# EasyEDA Pro project AD9959-DDS模块DA转换-函数发生器【国电信号仪表题】_2025-04-27_17-19-20.eprj

# Schematic AD9959-DDS模块DA转换-函数发生器【国电信号仪表题】
Board Name: AD9959-DDS模块DA转换-函数发生器【国电信号仪表题】; Create Date: 2025-07-15; Page Name: AD9959---DDS模块DA转换; Project Name: AD9959-DDS模块DA转换-函数发生器【国电信号仪表题】_2025-04-27_17-19-20; Schematic Name: AD9959-DDS模块DA转换-函数发生器【国电信号仪表题】; Update Date: 2025-07-18; Add into BOM: yes; Company: GDUT ELC; Convert to PCB: yes; Date: 2021-05-15; Draw By: 下岗工人再就业队; REV: 1.0; Sheet: 1/1
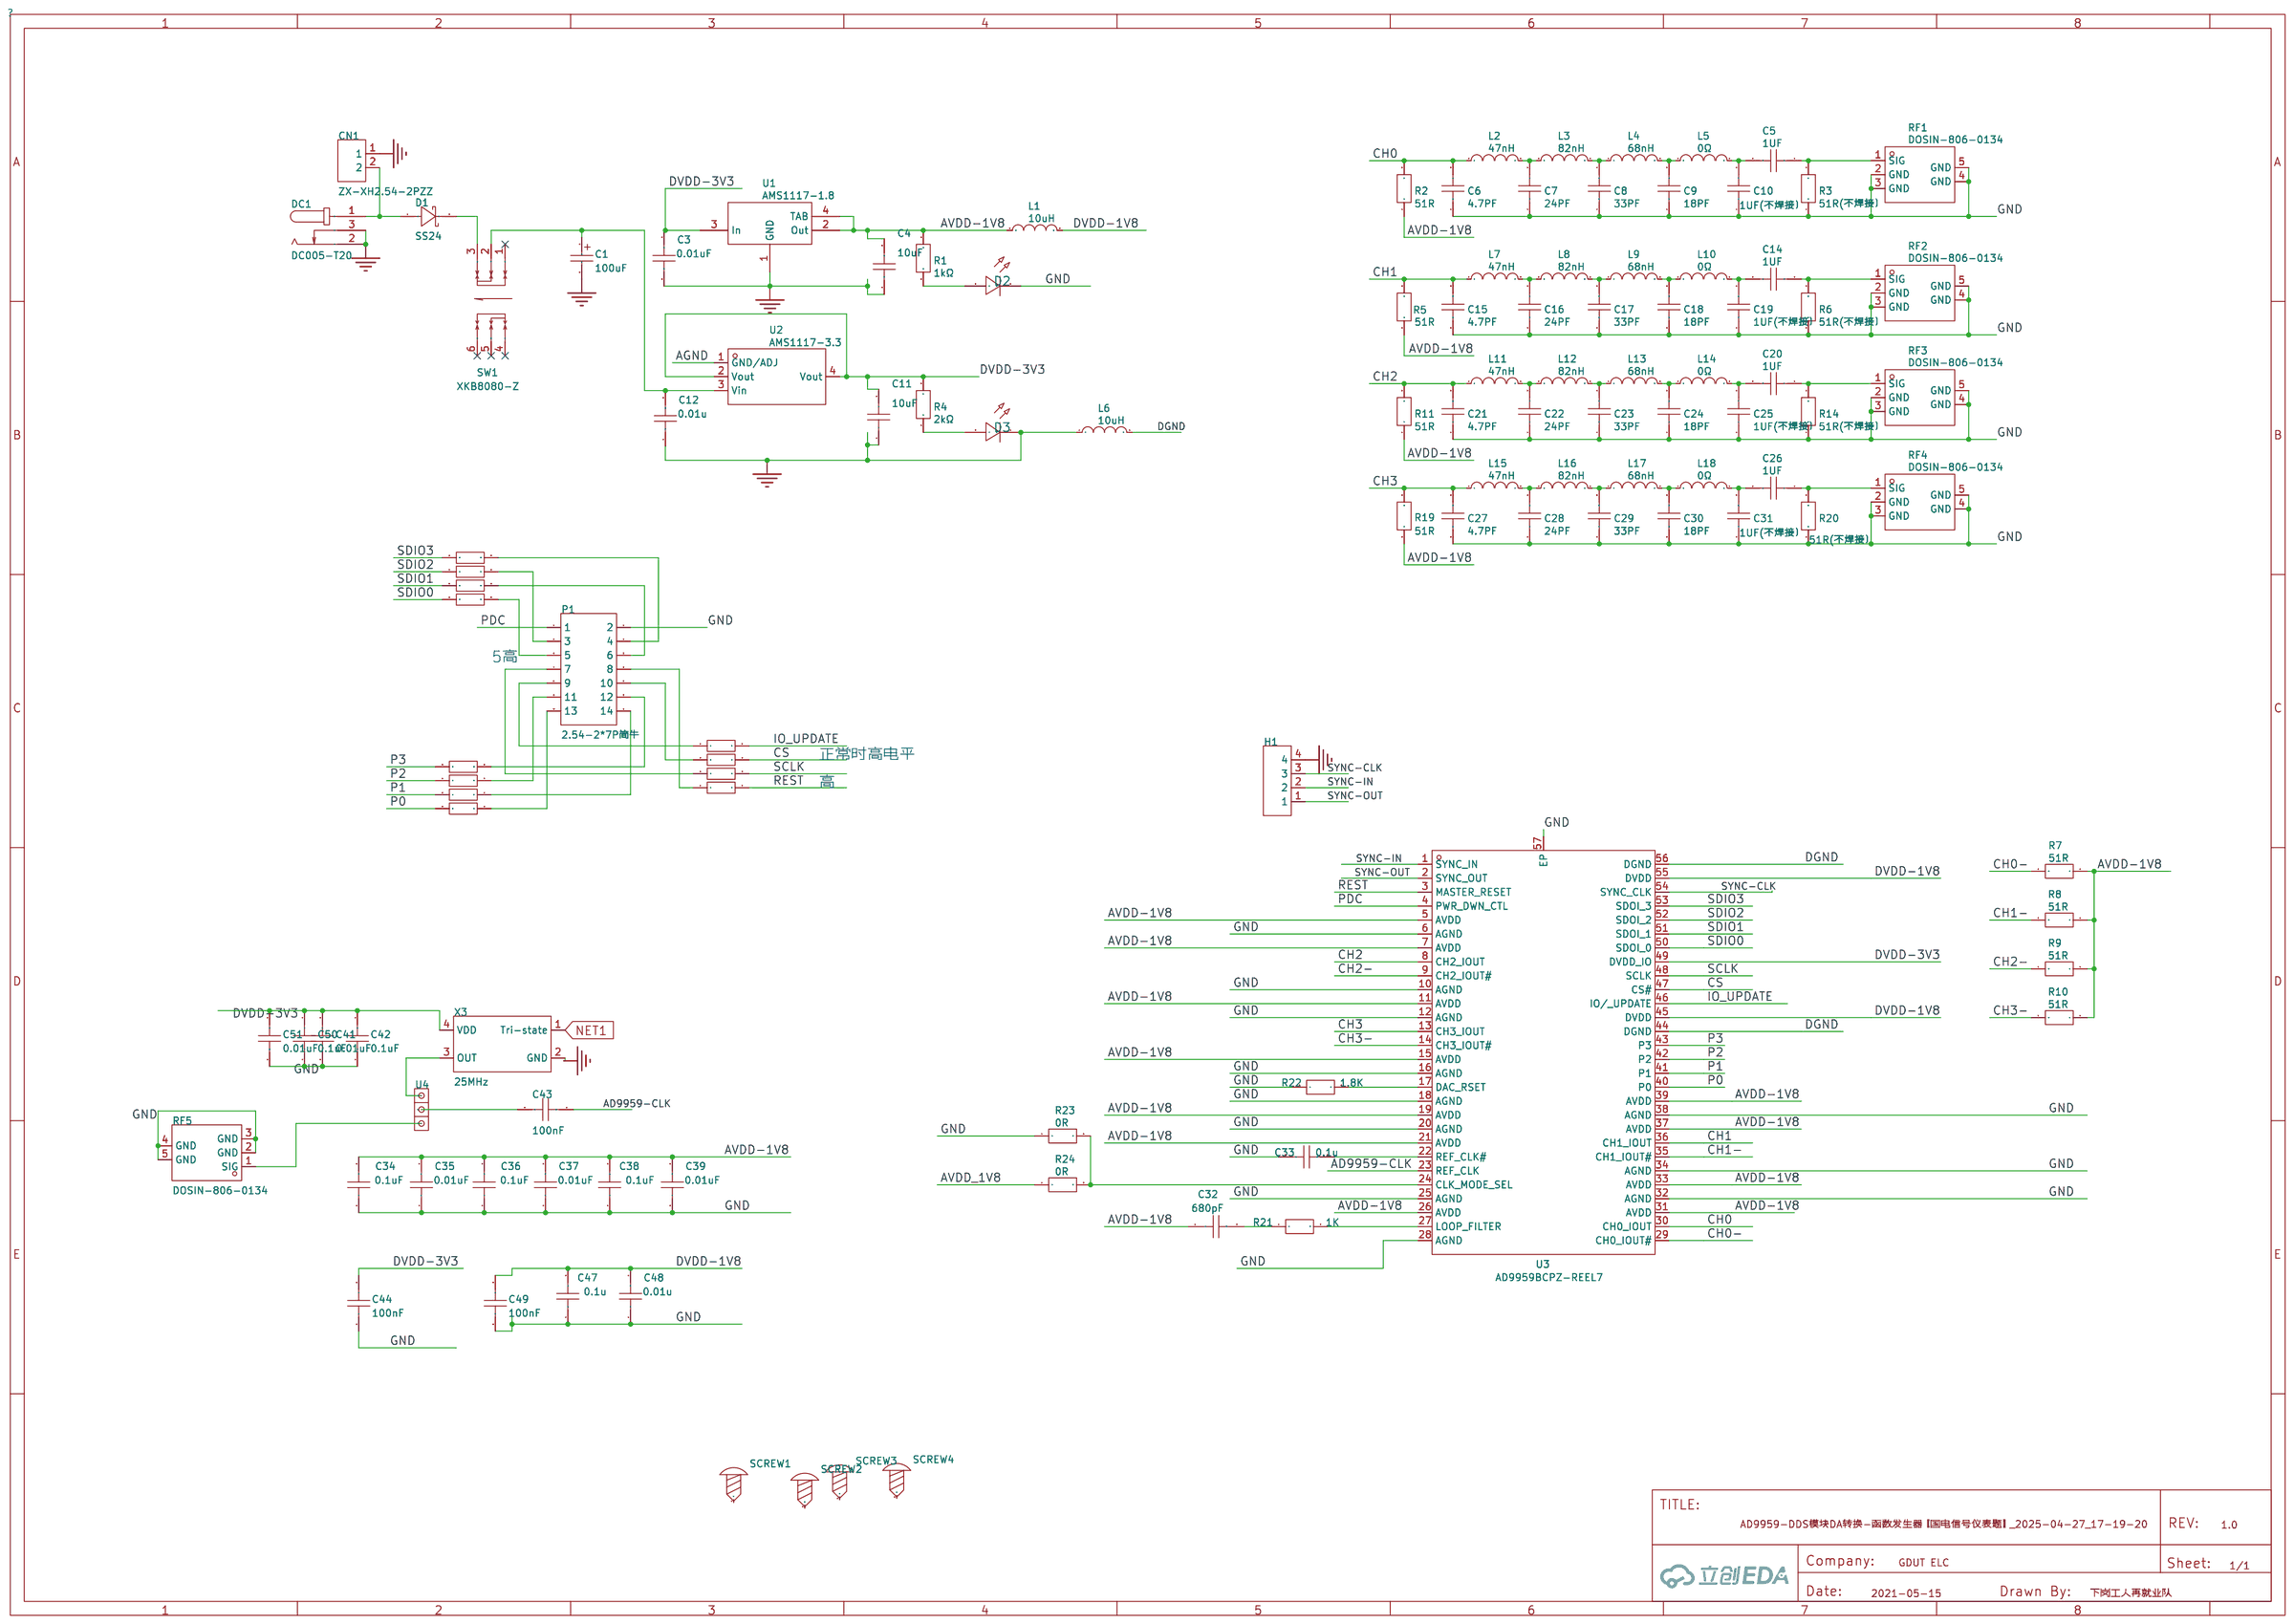
[diagram p0: schematic sheet]

## Parts
C1  100uF  [CASE-D_7343]
C3  0.01uF  [R0805]
C4  10uF  [C1210]
C5  1UF  [R0805]
C6  4.7PF  [R0805]
C7  24PF  [R0805]
C8  33PF  [R0805]
C9  18PF  [R0805]
C10  1UF(不焊接）  [R0805]
C11  10uF  [C1210]
C12  0.01u  [R0805]
C14  1UF  [R0805]
C15  4.7PF  [R0805]
C16  24PF  [R0805]
C17  33PF  [R0805]
C18  18PF  [R0805]
C19  1UF(不焊接）  [R0805]
C20  1UF  [R0805]
C21  4.7PF  [R0805]
C22  24PF  [R0805]
C23  33PF  [R0805]
C24  18PF  [R0805]
C25  1UF(不焊接）  [R0805]
C26  1UF  [R0805]
C27  4.7PF  [R0805]
C28  24PF  [R0805]
C29  33PF  [R0805]
C30  18PF  [R0805]
C31  1UF(不焊接）  [R0805]
C32  680pF  [R0805]
C33  0.1u  [R0805]
C34  0.1uF  [R0805]
C35  0.01uF  [R0805]
C36  0.1uF  [R0805]
C37  0.01uF  [R0805]
C38  0.1uF  [R0805]
C39  0.01uF  [R0805]
C41  0.01uF  [R0805]
C42  0.1uF  [R0805]
C43  100nF  [R0805]
C44  100nF  [C1206]
C47  0.1u  [R0805]
C48  0.01u  [R0805]
C49  100nF  [C1206]
C50  0.1uF  [R0805]
C51  0.01uF  [R0805]
CN1  ZX-XH2.54-2PZZ  [CONN-TH_2P-P2.50_HX25003-2A]
D1  SS24  [SMA_L4.3-W2.6-LS5.0-FD]
D2  -  [LED_0603]
D3  -  [LED_0603]
DC1  DC005-T20  [DC-IN-TH_DC005-T20]
H1  -  [HDR-TH_4P-P2.54-V-M]
L1  10uH  [R0805]
L2  47nH  [R0805]
L3  82nH  [R0805]
L4  68nH  [R0805]
L5  0Ω  [R0805]
L6  10uH  [R0805]
L7  47nH  [R0805]
L8  82nH  [R0805]
L9  68nH  [R0805]
L10  0Ω  [R0805]
L11  47nH  [R0805]
L12  82nH  [R0805]
L13  68nH  [R0805]
L14  0Ω  [R0805]
L15  47nH  [R0805]
L16  82nH  [R0805]
L17  68nH  [R0805]
L18  0Ω  [R0805]
P1  2.54-2*7P简牛  [IDC-TH_14P-P2.54-V-R2-C7-S2.54]
R1  1kΩ  [R0805]
R2  51R  [R0805]
R3  51R(不焊接）  [R0805]
R4  2kΩ  [R0805]
R5  51R  [R0805]
R6  51R(不焊接）  [R0805]
R7  51R  [R0805]
R8  51R  [R0805]
R9  51R  [R0805]
R10  51R  [R0805]
R11  51R  [R0805]
R14  51R(不焊接）  [R0805]
R19  51R  [R0805]
R20  51R(不焊接）  [R0805]
R21  1K  [R0805]
R22  1.8K  [R0805]
R23  0R  [R0805]
R24  0R  [R0805]
R25  10K  [R0805]
R26  10K  [R0805]
R27  10K  [R0805]
R28  10K  [R0805]
R29  10K  [R0805]
R30  10K  [R0805]
R31  10K  [R0805]
R32  10K  [R0805]
R33  10K  [R0805]
R34  10K  [R0805]
R35  10K  [R0805]
R36  10K  [R0805]
RF1  DOSIN-806-0134  [footprint_bc67]
RF2  DOSIN-806-0134  [footprint_bc67]
RF3  DOSIN-806-0134  [footprint_bc67]
RF4  DOSIN-806-0134  [footprint_bc67]
RF5  DOSIN-806-0134  [footprint_bc67]
SCREW1  -  [M3螺丝]
SCREW2  -  [M3螺丝]
SCREW3  -  [M3螺丝]
SCREW4  -  [M3螺丝]
SW1  XKB8080-Z  [footprint_acf5]
U1  AMS1117-1.8  [footprint_4fcc]
U2  AMS1117-3.3  [footprint_1b84]
U3  AD9959BCPZ-REEL7  [footprint_2d52]
U4  -  [1*3跳线]
X3  25MHz  [OSC-SMD_4P-L5.0-W3.2-BL_A]

## Library data of the parts
C1 = TAJD107K016RNJ: LCSC Part Name: 100uF ±10% 16V; Supplier Part: C7223; Manufacturer: Kyocera AVX; Supplier Footprint: CASE-D-7343; JLCPCB Part Class: 扩展库; Datasheet: https://atta.szlcsc.com/upload/public/pdf/source/20160107/1457707750344.pdf; Supplier: LCSC; Tolerance: ±10%; Rated Voltage: 16V; Equivalent Series Resistance(ESR): 600mΩ@100kHz; Operating Temperature: -55℃~+125℃
C3 C35 C37 C39 C41 C51 = 0.01uF
C4 C11 = CL32B106KBJNNNE: LCSC Part Name: 10uF ±10% 50V; Supplier Part: C138687; Manufacturer: SAMSUNG(三星); Supplier Footprint: 1210; JLCPCB Part Class: 扩展库; Datasheet: https://atta.szlcsc.com/upload/public/pdf/source/20190426/C138687_F326FA7378191C6A10A83DC717674AAD.pdf; Supplier: LCSC; Tolerance: ±10%; Voltage Rated: 50V; Temperature Coefficient: X7R
C5 C14 C20 C26 = 1UF
C6 C15 C21 C27 = 4.7PF
C7 C16 C22 C28 = 24PF
C8 C17 C23 C29 = 33PF
C9 C18 C24 C30 = 18PF
C10 C19 C25 C31 = 1UF(不焊接）
C12 C48 = 0.01u
C32 = 680pF
C33 C47 = 0.1u
C34 C36 C38 C42 C50 = 0.1uF
C43 = CAP_0603: Supplier Footprint: 0603
C44 C49 = CAP_1206: Supplier Footprint: 1206
CN1 = ZX-XH2.54-2PZZ: LCSC Part Name: 1x2P 间距:2.5mm 直插 系列:XH; Supplier Part: C7429632; Manufacturer: Megastar(兆星); Supplier Footprint: 插件,P=2.5mm; JLCPCB Part Class: 扩展库; Datasheet: https://atta.szlcsc.com/upload/public/pdf/source/20230619/19BA6947230AA44A04D3EDD65E618FD0.pdf; Supplier: LCSC; Pins Structure: 1x2P; Pitch: 2.5mm; Mounting Type: 直插; Reference Series: XH; Number of Pins: 2P; Number of Rows: 1; Number of PINs Per Row: 2; Current Rating: 3A; Contact Material: 黄铜; Contact Plating: 锡; Operating Temperature: -25℃~+85℃; Voltage Rating: 250V; Plastic Material: PA66; Flame Retardant Rating: UL94V-0; Color: 白色; Z-Height of the Board: 7mm; X-Length of Bottom Edge on Board (Spacing Line): 7.5mm; Y-Width of Bottom Edge on Board: 5.9mm
D1 = SS24_C7420362: LCSC Part Name: 电压:40V 电流:2A; Supplier Part: C7420362; Manufacturer: 宏迦橙; Supplier Footprint: SMA(DO-214AC); JLCPCB Part Class: 扩展库; Datasheet: https://atta.szlcsc.com/upload/public/pdf/source/20230828/2D67628D7EFDC2DD386D167E8AEA232D.pdf; Supplier: LCSC; Diode Configuration: 独立式; Forward Voltage (Vf@If): 550mV@1.0A; Reverse Voltage (Vr): 40V; Rectified Current: 2A; Reverse Leakage Current (Ir): 200uA@40V
D2 D3 = LED_0603-R: Supplier Footprint: 0603
DC1 = DC005-T20: LCSC Part Name: DC电源插座 内径:2mm 外径:6.3mm; Supplier Part: C111567; Manufacturer: SOFNG(硕方); Supplier Footprint: 插件; JLCPCB Part Class: 扩展库; Datasheet: https://atta.szlcsc.com/upload/public/pdf/source/20221107/9EED2DEB01414D87A9494EDA89F4C173.pdf; Supplier: LCSC; Connector Type: DC电源插座; Mounting Type: 弯插; Inside Contact Diameter: 2mm; Outside Contact Diameter: 6.3mm; Current Rating: 3A; Voltage Rating (Max): 12V; Operating Temperature: -10℃~+60℃
H1 = HDR-M_2.54_1x4P: Supplier Part: C492403; Supplier Footprint: 插件
L1 L6 = 10uH: Supplier: LCSC; Supplier Part: C524976; Manufacturer: Taiyo Yuden; Manufacturer Part: LK2125100K-T
L2 L7 L11 L15 = 47nH: Supplier: LCSC; Manufacturer: Sunlord; Manufacturer Part: SDCL1608C47NJTDF; Supplier Part: C29683; JLCPCB Part Class: Basic Part
L3 L8 L12 L16 = 82nH: Supplier: LCSC; Manufacturer: Sunlord; Manufacturer Part: SDCL1608C82NJTDF; Supplier Part: C23473; JLCPCB Part Class: Extended Part
L4 L9 L13 L17 = 68nH: Supplier: LCSC; Manufacturer: Sunlord; Manufacturer Part: SDCL1608C68NJTF; Supplier Part: C13415; JLCPCB Part Class: Basic Part
L5 L10 L14 L18 = 0Ω: Supplier: LCSC; Manufacturer: FH; Manufacturer Part: CBG160808U000T; Supplier Part: C43163; JLCPCB Part Class: Extended Part
P1 = 2.54-2*7P简牛: LCSC Part Name: 2.54mm 2x7P 排数:2 每排P数:7; Supplier Part: C11215; Manufacturer: BOOMELE(博穆精密); Supplier Footprint: 插件,P=2.54mm; JLCPCB Part Class: 扩展库; Datasheet: https://atta.szlcsc.com/upload/public/pdf/source/20131122/1457706661483.pdf; Supplier: LCSC; Connector Type: 简牛座; Pitch: 2.54mm; Structure: 2x7P; Holder Type: 直插; Row Spacing: 2.54mm; Number of Rows: 2; Pin Number in each Row: 7; Contact Material: 黄铜; Contact Plating: 金
R1 = 1kΩ
R2 R5 R7-R11 R19 = 51R
R3 R6 R14 R20 = 51R(不焊接）
R4 = 2kΩ
R21 = 680R
R22 = 2.0k
R23 R24 = 0R
R25-R36 = Res_0603: Supplier Footprint: 0603
RF1-RF5 = DOSIN-806-0134: Supplier: LCSC; Supplier Part: C709670; Manufacturer: dosinconn(德索五金); JLCPCB Part Class: Extended Part
SCREW1-SCREW4 = M3螺丝: Supplier Footprint: 插件
SW1 = XKB8080-Z: Supplier: LCSC; Supplier Part: C318860; Manufacturer: XKB Enterprise; JLCPCB Part Class: Extended Part
U1 = AMS1117-1.8: Supplier: LCSC; Manufacturer: AMS; image: //image.lceda.cn/szlcsc/C6185.jpg; Supplier Part: C6185; JLCPCB Part Class: Extended Part
U2 = AMS1117-3.3: Supplier: LCSC; Manufacturer: AMS; image: //image.lceda.cn/szlcsc/C6186.jpg; Supplier Part: C6186; JLCPCB Part Class: Basic Part
U3 = AD9959BCPZ-REEL7: Supplier: LCSC; Supplier Part: C653947; Manufacturer: ADI(亚德诺)/LINEAR
U4 = 1*3跳线
X3 = OT503225MJBA4SL: LCSC Part Name: YSO110TR 25MHZ 4P 5032 1.8V-3.3V ±10PPM -40~85℃（±20PPM) CMOS; Supplier Part: C717795; Manufacturer: YXC(扬兴晶振); Supplier Footprint: SMD5032-4P; JLCPCB Part Class: 扩展库; Datasheet: https://atta.szlcsc.com/upload/public/pdf/source/20240731/596E5F7673E50DA744B7F79F139FB8DF.pdf; Supplier: LCSC; Normal temperature Frequency Tolerance: ±10ppm; Output Type: CMOS; Voltage - Supply: 1.8V~3.3V; Frequency Stability: ±20ppm; Operating Temperature: -40℃~+85℃

## Nets
AGND: U2.1(GND/ADJ)
AVDD-1V8: C4.2 C32.1 C34.2 C35.2 C36.2 C37.2 C38.2 C39.2 L1.1 R1.2 R2.1 R5.1 R7.1 R8.1 R9.1 R10.1 R11.1 R19.1 U1.2(Out) U1.4(TAB) U3.5(AVDD) U3.7(AVDD) U3.11(AVDD) U3.15(AVDD) U3.19(AVDD) U3.21(AVDD) U3.26(AVDD) U3.31(AVDD) U3.33(AVDD) U3.37(AVDD) U3.39(AVDD)
AVDD_1V8: R24.1
DGND: L6.2 U3.44(DGND) U3.56(DGND)
DVDD-1V8: C47.2 C48.2 C49.2 L1.2 U3.45(DVDD) U3.55(DVDD)
DVDD-3V3: C3.2 C11.2 C41.1 C42.1 C44.2 C50.1 C51.1 R4.2 U1.3(In) U2.2(Vout) U2.4(Vout) U3.49(DVDD_IO) X3.4(VDD)
GND: C1.2 C3.1 C4.1 C6.1 C7.1 C8.1 C9.1 C10.1 C11.1 C12.1 C15.1 C16.1 C17.1 C18.1 C19.1 C21.1 C22.1 C23.1 C24.1 C25.1 C27.1 C28.1 C29.1 C30.1 C31.1 C33.1 C34.1 C35.1 C36.1 C37.1 C38.1 C39.1 C41.2 C42.2 C44.1 C47.1 C48.1 C49.1 C50.2 C51.2 CN1.1 D2.1(C) D3.1(C) DC1.2 DC1.3 H1.4 L6.1 P1.2 R3.1 R6.1 R14.1 R20.1 R22.1 R23.1 RF1.2(GND) RF1.3(GND) RF1.4(GND) RF1.5(GND) RF2.2(GND) RF2.3(GND) RF2.4(GND) RF2.5(GND) RF3.2(GND) RF3.3(GND) RF3.4(GND) RF3.5(GND) RF4.2(GND) RF4.3(GND) RF4.4(GND) RF4.5(GND) RF5.2(GND) RF5.3(GND) RF5.4(GND) RF5.5(GND) U1.1(GND) U3.6(AGND) U3.10(AGND) U3.12(AGND) U3.16(AGND) U3.18(AGND) U3.20(AGND) U3.25(AGND) U3.28(AGND) U3.32(AGND) U3.34(AGND) U3.38(AGND) U3.57(EP) X3.2(GND)
AD9959-CLK: C43.2 U3.23(REF_CLK)
CH0: C6.2 L2.1 R2.2 U3.30(CH0_IOUT)
CH0-: R7.2 U3.29(CH0_IOUT#)
CH1: C15.2 L7.1 R5.2 U3.36(CH1_IOUT)
CH1-: R8.2 U3.35(CH1_IOUT#)
CH2: C21.2 L11.1 R11.2 U3.8(CH2_IOUT)
CH2-: R9.2 U3.9(CH2_IOUT#)
CH3: C27.2 L15.1 R19.2 U3.13(CH3_IOUT)
CH3-: R10.2 U3.14(CH3_IOUT#)
CS: R34.2 U3.47(CS#)
IO_UPDATE: R33.2 U3.46(IO/_UPDATE)
NET1: X3.1(Tri-state)
P0: R32.1 U3.40(P0)
P1: R31.1 U3.41(P1)
P2: R30.1 U3.42(P2)
P3: R29.1 U3.43(P3)
PDC: P1.1 U3.4(PWR_DWN_CTL)
REST: R36.2 U3.3(MASTER_RESET)
SCLK: R35.2 U3.48(SCLK)
SDIO0: R28.1 U3.50(SDOI_0)
SDIO1: R27.1 U3.51(SDOI_1)
SDIO2: R26.1 U3.52(SDOI_2)
SDIO3: R25.1 U3.53(SDOI_3)
SYNC-CLK: H1.3 U3.54(SYNC_CLK)
SYNC-IN: H1.2 U3.1(SYNC_IN)
SYNC-OUT: H1.1 U3.2(SYNC_OUT)
$1N34: R22.2 U3.17(DAC_RSET)
$1N39: C33.2 U3.22(REF_CLK#)
$1N43: R21.2 U3.27(LOOP_FILTER)
$1N48: C32.2 R21.1
$1N72: C1.1 C12.2 SW1.2 U2.3(Vin)
$1N80: D2.2(A) R1.1
$1N83: D3.2(A) R4.1
$1N111: C7.2 L2.2 L3.1
$1N112: C8.2 L3.2 L4.1
$1N113: C9.2 L4.2 L5.1
$1N114: C5.2 C10.2 L5.2
$1N115: C5.1 R3.2 RF1.1(SIG)
$1N121: C14.1 R6.2 RF2.1(SIG)
$1N122: C14.2 C19.2 L10.2
$1N123: C18.2 L9.2 L10.1
$1N124: C17.2 L8.2 L9.1
$1N125: C16.2 L7.2 L8.1
$1N130: C20.1 R14.2 RF3.1(SIG)
$1N131: C20.2 C25.2 L14.2
$1N132: C24.2 L13.2 L14.1
$1N133: C23.2 L12.2 L13.1
$1N134: C22.2 L11.2 L12.1
$1N139: C26.1 R20.2 RF4.1(SIG)
$1N140: C26.2 C31.2 L18.2
$1N141: C30.2 L17.2 L18.1
$1N142: C29.2 L16.2 L17.1
$1N143: C28.2 L15.2 L16.1
$1N149: D1.2(K) SW1.3
$1N152: P1.4 R25.2
$1N153: P1.3 R26.2
$1N154: P1.6 R27.2
$1N155: P1.5 R28.2
$1N156: P1.9 R33.1
$1N157: P1.10 R34.1
$1N158: P1.13 R32.2
$1N159: P1.14 R31.2
$1N160: P1.11 R30.2
$1N161: P1.12 R29.2
$1N162: P1.7 R35.1
$1N163: P1.8 R36.1
$1N168: R23.2 R24.2 U3.24(CLK_MODE_SEL)
$1N5889: U4.3 X3.3(OUT)
$1N5898: C43.1 U4.2
$1N5956: RF5.1(SIG) U4.1
$1N9705: CN1.2 D1.1(A) DC1.1

Not connected (* = marked no-connect by the designer): SCREW1 1; SCREW2 1; SCREW3 1; SCREW4 1; SW1 1* 4* 5* 6*

## Notes on the sheet
- 5高
- 正常时高电平
- 高

# Board PCB_AD9959---DDS模块DA转换
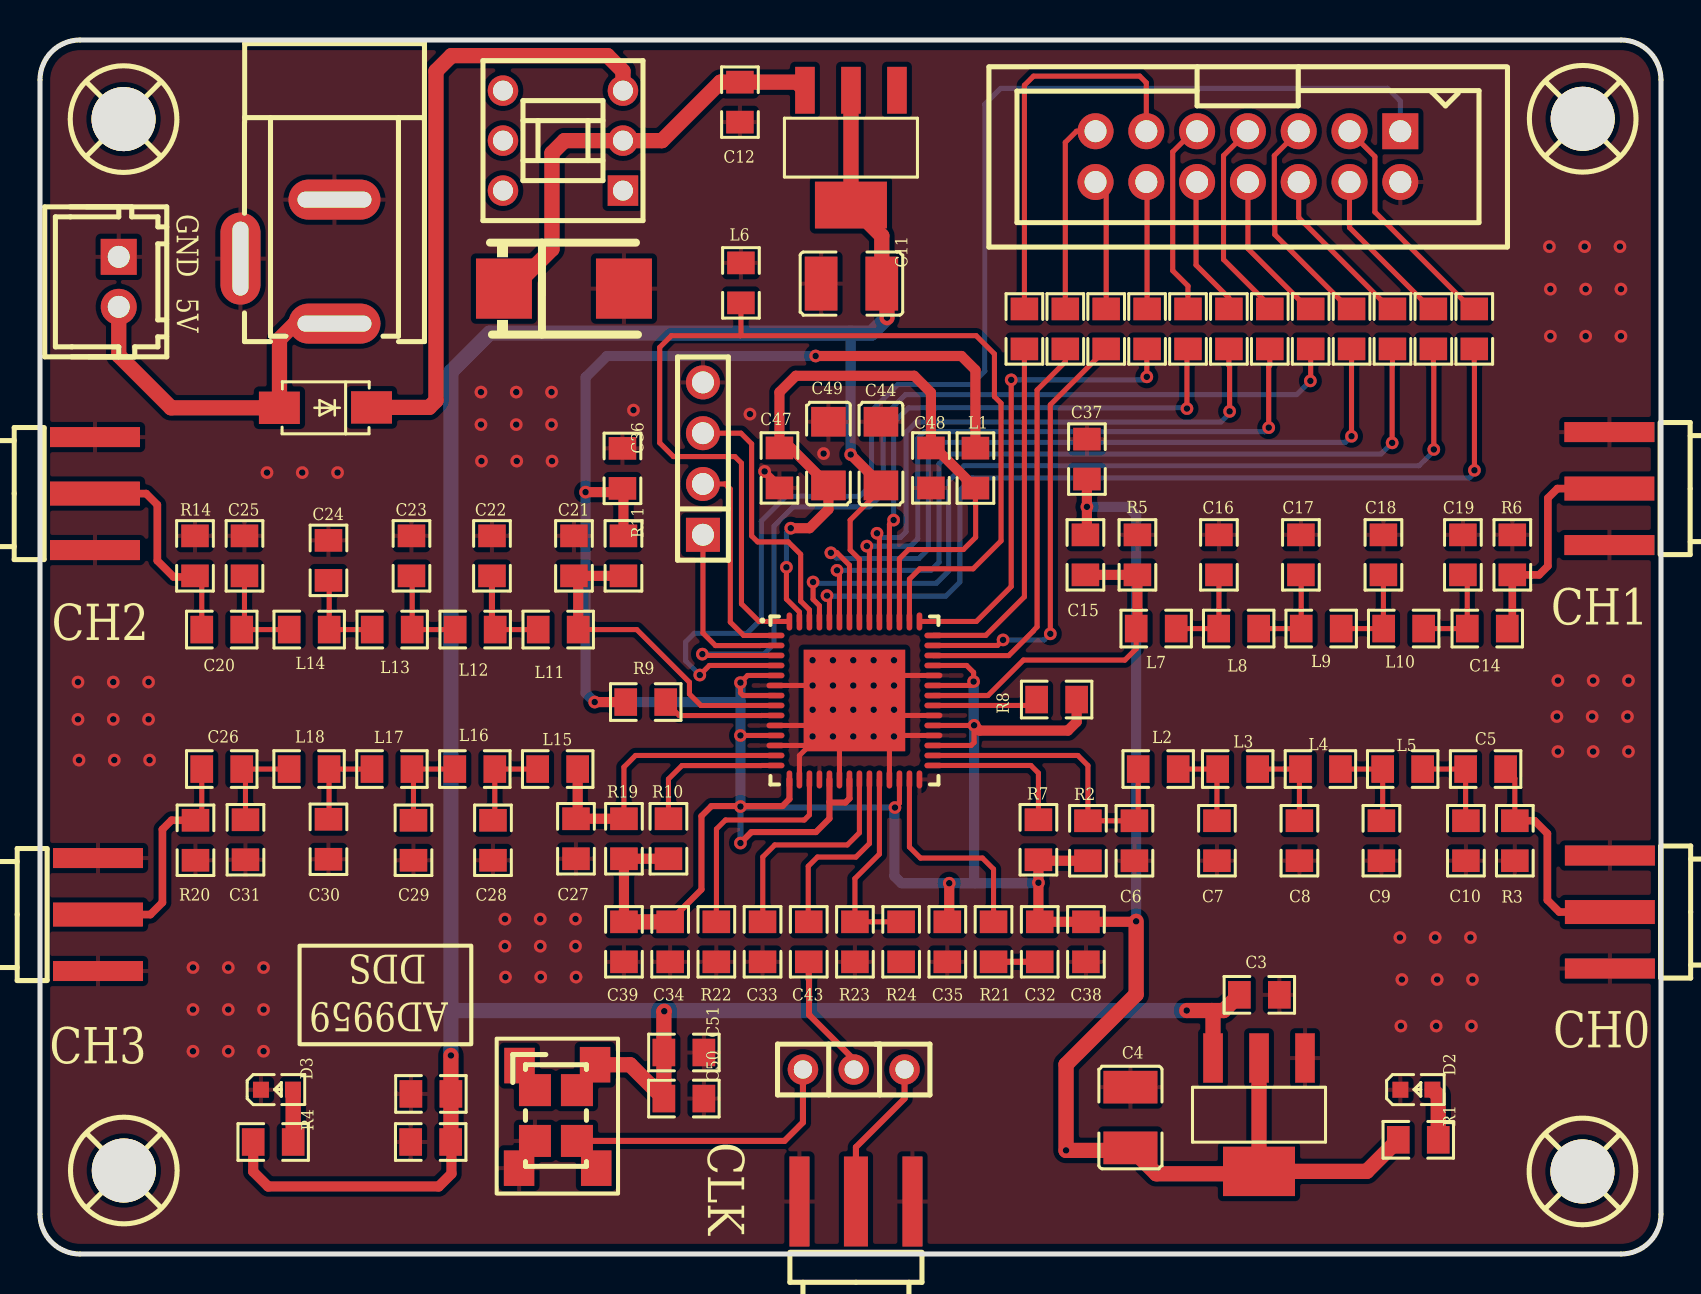
[diagram p1: board, top side]
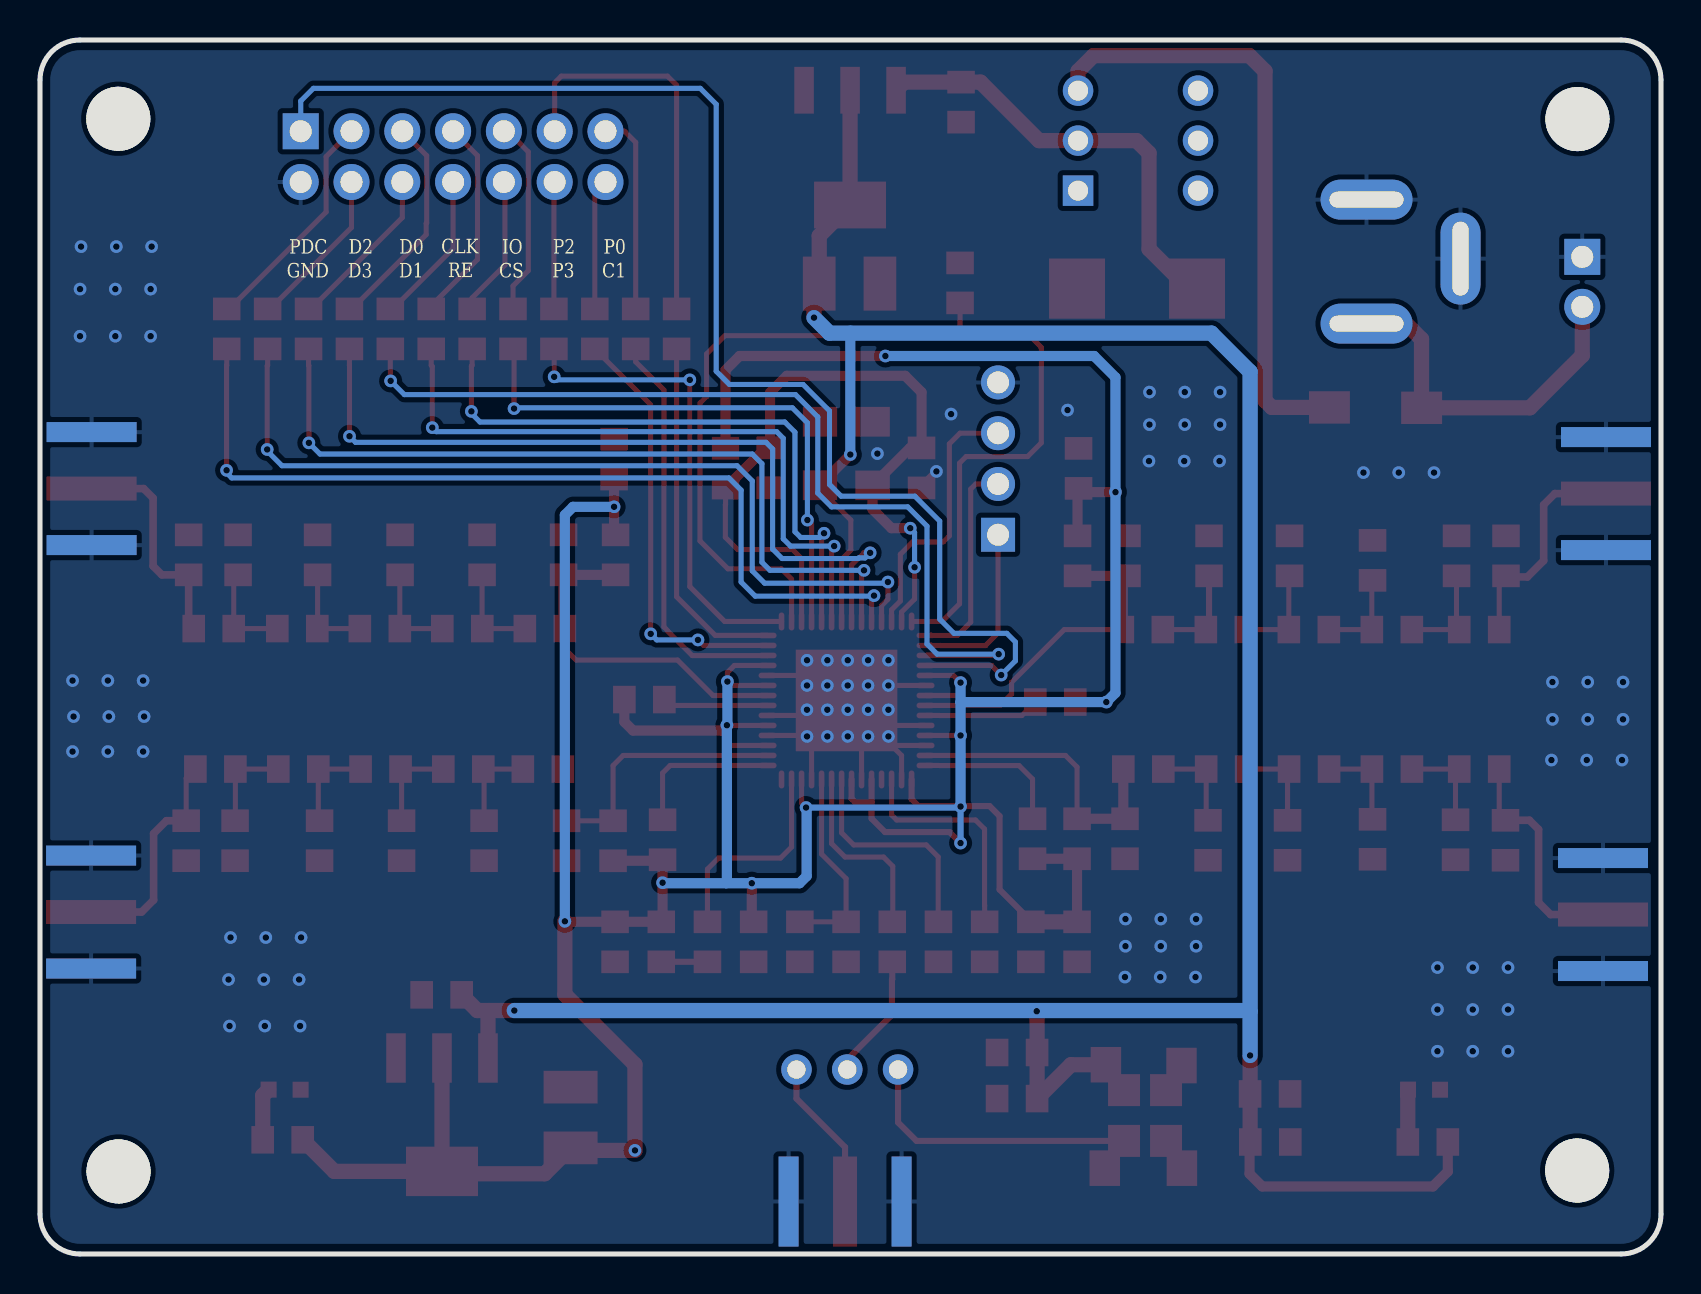
[diagram p2: board, bottom side, seen from below]

Outline 81.06 x 60.71 mm; copper layers: Top Layer, Bottom Layer. Coordinates in mm from the lower left corner of the outline.
Outline path: 0,58.71 0,2 arc(0.59,0.59) 2,0 79.06,0 arc(80.47,0.59) 81.06,2 81.06,58.71 arc(80.47,60.12) 79.06,60.71 2,60.71 arc(0.59,60.12) 0,58.71
Stack: Top Layer 0.035mm / Dielectric1 1.51mm FR4 er 4.5 / Bottom Layer 0.035mm

## Design rules (mm)
template: 用户自定义配置
spacing Default (default): track to track 0.178, other pairs 0 to 0.178
track width Default (default): min 0.254, default 0.305, max 25.4
differential pair differentialPair (default): width min 0.127, default 0.254, max 2.54; gap min 0.152, default 0.152
via Default (default): diameter min 0.635, default 0.635, max 100.025; hole min 0.33, default 0.33, max 59.995
net AGND uses gge12092

## Placement (name value [footprint] x y rotation side)
C1  100uF  [CASE-D_7343]  26.2 48.28 180 top
C3  0.01uF  [R0805]  60.86 12.96 180 top
C4  10uF  [C1210]  54.53 6.83 270 top
C5  1UF  [R0805]  72.18 24.25 180 top
C6  4.7PF  [R0805]  54.73 20.78 90 top
C7  24PF  [R0805]  58.85 20.78 90 top
C8  33PF  [R0805]  62.98 20.78 90 top
C9  18PF  [R0805]  67.08 20.78 90 top
C10  1UF(不焊接）  [R0805]  71.3 20.78 90 top
C11  10uF  [C1210]  40.58 48.53 0 top
C12  0.01u  [R0805]  35 57.71 90 top
C14  1UF  [R0805]  72.26 31.28 180 top
C15  4.7PF  [R0805]  54.88 34.85 270 top
C16  24PF  [R0805]  58.95 34.85 270 top
C17  33PF  [R0805]  63.05 34.85 270 top
C18  18PF  [R0805]  67.18 34.85 270 top
C19  1UF(不焊接）  [R0805]  71.15 34.85 270 top
C20  1UF  [R0805]  9.2 31.23 0 top
C21  4.7PF  [R0805]  26.7 34.8 270 top
C22  24PF  [R0805]  22.6 34.8 270 top
C23  33PF  [R0805]  18.58 34.8 270 top
C24  18PF  [R0805]  14.43 34.58 270 top
C25  1UF(不焊接）  [R0805]  10.23 34.8 270 top
C26  1UF  [R0805]  9.2 24.25 0 top
C27  4.7PF  [R0805]  26.8 20.88 90 top
C28  24PF  [R0805]  22.65 20.8 90 top
C29  33PF  [R0805]  18.68 20.8 90 top
C30  18PF  [R0805]  14.43 20.85 90 top
C31  1UF(不焊接）  [R0805]  10.28 20.83 90 top
C32  680pF  [R0805]  49.99 15.5 270 top
C33  0.1u  [R0805]  36.13 15.72 90 top
C34  0.1uF  [R0805]  31.51 15.72 90 top
C35  0.01uF  [R0805]  45.37 15.72 90 top
C36  0.1uF  [R0805]  29.13 39.18 270 top
C37  0.01uF  [R0805]  52.35 39.64 270 top
C38  0.1uF  [R0805]  52.3 15.72 90 top
C39  0.01uF  [R0805]  29.2 15.72 90 top
C41  0.01uF  [R0805]  19.44 8.01 180 top
C42  0.1uF  [R0805]  19.43 5.6 180 top
C43  100nF  [R0805]  38.44 15.72 90 top
C44  100nF  [C1206]  42.05 40.03 270 top
C47  0.1u  [R0805]  36.98 39.42 90 top
C48  0.01u  [R0805]  44.55 39.42 90 top
C49  100nF  [C1206]  39.43 40.03 270 top
C50  0.1uF  [R0805]  32.31 7.77 0 top
C51  0.01uF  [R0805]  32.31 10.08 0 top
CN1  ZX-XH2.54-2PZZ  [CONN-TH_2P-P2.50_HX25003-2A]  3.94 48.62 270 top
D1  SS24  [SMA_L4.3-W2.6-LS5.0-FD]  14.28 42.33 0 top
D2  -  [LED_0603]  68.88 8.23 0 top
D3  -  [LED_0603]  11.9 8.23 0 top
DC1  DC005-T20  [DC-IN-TH_DC005-T20]  12.38 49.63 270 top
H1  -  [HDR-TH_4P-P2.54-V-M]  33.15 39.78 90 top
L1  10uH  [R0805]  46.78 39.19 270 top
L2  47nH  [R0805]  56.03 24.25 0 top
L3  82nH  [R0805]  60 24.25 0 top
L4  68nH  [R0805]  64.14 24.25 0 top
L5  0Ω  [R0805]  68.25 24.25 0 top
L6  10uH  [R0805]  35.05 48.45 270 top
L7  47nH  [R0805]  55.93 31.28 0 top
L8  82nH  [R0805]  60.05 31.28 0 top
L9  68nH  [R0805]  64.18 31.28 0 top
L10  0Ω  [R0805]  68.3 31.28 0 top
L11  47nH  [R0805]  25.8 31.23 180 top
L12  82nH  [R0805]  21.65 31.23 180 top
L13  68nH  [R0805]  17.5 31.23 180 top
L14  0Ω  [R0805]  13.35 31.23 180 top
L15  47nH  [R0805]  25.78 24.25 180 top
L16  82nH  [R0805]  21.63 24.25 180 top
L17  68nH  [R0805]  17.49 24.25 180 top
L18  0Ω  [R0805]  13.34 24.25 180 top
NOREF  -  [Pad_e1856]  27.76 9.47 0 top
NOREF#2  -  [Pad_e1854]  23.96 4.29 0 top
NOREF#3  -  [Pad_e1855]  23.98 9.42 0 top
NOREF#4  -  [Pad_e1852]  27.81 4.29 0 top
P1  2.54-2*7P简牛  [IDC-TH_14P-P2.54-V-R2-C7-S2.54]  60.4 54.88 180 top
R1  1kΩ  [R0805]  68.81 5.71 180 top
R2  51R  [R0805]  52.4 20.78 90 top
R3  51R(不焊接）  [R0805]  73.75 20.78 90 top
R4  2kΩ  [R0805]  11.55 5.6 180 top
R5  51R  [R0805]  52.28 34.85 270 top
R6  51R(不焊接）  [R0805]  73.63 34.85 270 top
R7  51R  [R0805]  49.93 20.83 90 top
R8  51R  [R0805]  50.73 27.73 180 top
R9  51R  [R0805]  30.4 27.6 0 top
R10  51R  [R0805]  31.43 20.88 90 top
R11  51R  [R0805]  29.18 34.8 270 top
R14  51R(不焊接）  [R0805]  7.75 34.8 270 top
R19  51R  [R0805]  29.2 20.88 90 top
R20  51R(不焊接）  [R0805]  7.78 20.8 90 top
R21  1K  [R0805]  47.68 15.72 90 top
R22  1.8K  [R0805]  33.82 15.72 90 top
R23  0R  [R0805]  40.75 15.72 90 top
R24  0R  [R0805]  43.06 15.72 90 top
R25  10K  [R0805]  69.68 46.37 90 top
R26  10K  [R0805]  71.72 46.37 90 top
R27  10K  [R0805]  67.63 46.37 90 top
R28  10K  [R0805]  65.59 46.37 90 top
R29  10K  [R0805]  55.36 46.37 90 top
R30  10K  [R0805]  49.23 46.37 90 top
R31  10K  [R0805]  53.32 46.37 90 top
R32  10K  [R0805]  51.27 46.37 90 top
R33  10K  [R0805]  57.41 46.15 270 top
R34  10K  [R0805]  59.45 46.15 270 top
R35  10K  [R0805]  61.5 46.15 270 top
R36  10K  [R0805]  63.54 46.15 270 top
RF1  DOSIN-806-0134  [footprint_bc67]  78.5 17.1 270 top
RF2  DOSIN-806-0134  [footprint_bc67]  78.48 38.28 270 top
RF3  DOSIN-806-0134  [footprint_bc67]  2.75 38.03 90 top
RF4  DOSIN-806-0134  [footprint_bc67]  2.9 16.98 90 top
RF5  DOSIN-806-0134  [footprint_bc67]  40.8 2.62 180 top
SCREW1  -  [M3螺丝]  77.14 56.77 0 top
SCREW2  -  [M3螺丝]  4.18 56.75 0 top
SCREW3  -  [M3螺丝]  4.19 4.18 0 top
SCREW4  -  [M3螺丝]  77.13 4.13 0 top
SW1  XKB8080-Z  [footprint_acf5]  26.15 55.68 90 top
U1  AMS1117-1.8  [footprint_4fcc]  60.96 6.97 90 top
U2  AMS1117-3.3  [footprint_1b84]  40.55 55.33 90 top
U3  AD9959BCPZ-REEL7  [footprint_2d52]  40.73 27.68 270 top
U4  -  [1*3跳线]  38.15 9.23 270 top
X3  25MHz  [OSC-SMD_4P-L5.0-W3.2-BL_A]  25.8 6.93 270 top

## Footprints (pads in the part's own frame, mm; a bottom-side part is the same pattern mirrored in y, then rotated)
1*3跳线
  round 1.524 hole 0.914: 1(0,5.08) 2(0,2.54) 3(0,0)
C1206
  rect 1.485x1.728 smd: 1(-1.593,0) 2(1.593,0)
C1210
  rect 1.635x2.7 smd: 1(-1.518,0) 2(1.518,0)
CASE-D_7343
  rect 2.799x3.01 smd: 1(3,0) 2(-3,0)
CONN-TH_2P-P2.50_HX25003-2A
  rect 1.8x1.8 hole 1.1: 1(-1.25,0)
  round 1.8 hole 1.1: 2(1.25,0)
DC-IN-TH_DC005-T20
  oval 2x4.6 hole 0.8x3.7: 1(3.1,2.35) 2(-3.1,2.35)
  oval 4.6x2 hole 3.7x0.8: 3(-0.15,-2.35)
footprint_1b84
  rect 2.34x0.98 smd: 1(2.87,-2.3) 2(2.87,0) 3(2.87,2.3)
  rect 2.34x3.6 smd: 4(-2.87,0)
footprint_2d52
  oval 0.28x0.9 smd: 1(-3.252,-3.95) 2(-2.751,-3.95) 3(-2.251,-3.95) 4(-1.75,-3.95) 5(-1.25,-3.95) 6(-0.75,-3.95) 7(-0.249,-3.95) 8(0.249,-3.95) 9(0.749,-3.95) 10(1.25,-3.95) 11(1.75,-3.95) 12(2.251,-3.95) 13(2.751,-3.95) 14(3.251,-3.95) 29(3.251,3.95) 30(2.751,3.95) 31(2.251,3.95) 32(1.75,3.95) 33(1.25,3.95) 34(0.749,3.95) 35(0.249,3.95) 36(-0.249,3.95) 37(-0.75,3.95) 38(-1.25,3.95) 39(-1.75,3.95) 40(-2.251,3.95) 41(-2.751,3.95) 42(-3.252,3.95)
  oval 0.9x0.28 smd: 15(3.95,-3.251) 16(3.95,-2.751) 17(3.95,-2.251) 18(3.95,-1.75) 19(3.95,-1.25) 20(3.95,-0.749) 21(3.95,-0.249) 22(3.95,0.249) 23(3.95,0.75) 24(3.95,1.25) 25(3.95,1.75) 26(3.95,2.251) 27(3.95,2.751) 28(3.95,3.252) 43(-3.95,3.252) 44(-3.95,2.751) 45(-3.95,2.251) 46(-3.95,1.75) 47(-3.95,1.25) 48(-3.95,0.75) 49(-3.95,0.249) 50(-3.95,-0.249) 51(-3.95,-0.749) 52(-3.95,-1.25) 53(-3.95,-1.75) 54(-3.95,-2.251) 55(-3.95,-2.751) 56(-3.95,-3.251)
  rect 5.08x5.08 smd: 57(0,0)
footprint_4fcc
  rect 2.47x0.98 smd: 1(2.835,-2.3) 2(2.835,0) 3(2.835,2.3)
  rect 2.47x3.6 smd: 4(-2.835,0)
footprint_acf5
  rect 1.524x1.524 hole 1: 1(-2.5,-3)
  round 1.524 hole 1: 2(0,-3) 3(2.5,-3) 4(-2.5,3) 5(0,3) 6(2.5,3)
footprint_bc67
  rect 1.2x4.5 smd: 1(0,0)
  rect 1x4.5 smd: 2(-2.825,0) 3(2.825,0)
  rect 1x4.5 smd far side: 4(-2.825,0) 5(2.825,0)
HDR-TH_4P-P2.54-V-M
  rect 1.7x1.7 hole 1.1: 1(-3.81,0)
  round 1.7 hole 1.1: 2(-1.27,0) 3(1.27,0) 4(3.81,0)
IDC-TH_14P-P2.54-V-R2-C7-S2.54
  rect 1.8x1.8 hole 1.1: 1(-7.62,-1.27)
  round 1.8 hole 1.1: 2(-7.62,1.27) 3(-5.08,-1.27) 4(-5.08,1.27) 5(-2.54,-1.27) 6(-2.54,1.27) 7(0,-1.27) 8(0,1.27) 9(2.54,-1.27) 10(2.54,1.27) 11(5.08,-1.27) 12(5.08,1.27) 13(7.62,-1.27) 14(7.62,1.27)
LED_0603
  rect 0.8x0.8 smd: 1(-0.851,-0.01) 2(0.75,-0.005)
M3螺丝
  round 3.2 hole 3.2: 1(0,0)
OSC-SMD_4P-L5.0-W3.2-BL_A
  rect 1.6x1.6 smd: 1(-1.27,-1.05) 2(1.27,-1.05) 3(1.27,1.05) 4(-1.27,1.05)
Pad_e1852
  rect 1.524x1.778 smd: 1(0,0)
Pad_e1854
  rect 1.524x1.778 smd: 1(0,0)
Pad_e1855
  rect 1.524x1.778 smd: 1(0,0)
Pad_e1856
  rect 1.524x1.778 smd: 1(0,0)
R0805
  rect 1.133x1.377 smd: 1(-1.111,0) 2(0.889,0)
SMA_L4.3-W2.6-LS5.0-FD
  rect 2.046x1.62 smd: 1(-2.304,-0.009) 2(2.304,0.009)

## Nets
As in the schematic, except:
DVDD-3V3: C3.2 C11.2 C41.1 C42.1 C44.2 C50.1 C51.1 NOREF.1 R4.2 U1.3 U2.2 U2.4 U3.49 X3.4
GND: C1.2 C3.1 C4.1 C6.1 C7.1 C8.1 C9.1 C10.1 C11.1 C12.1 C15.1 C16.1 C17.1 C18.1 C19.1 C21.1 C22.1 C23.1 C24.1 C25.1 C27.1 C28.1 C29.1 C30.1 C31.1 C33.1 C34.1 C35.1 C36.1 C37.1 C38.1 C39.1 C41.2 C42.2 C44.1 C47.1 C48.1 C49.1 C50.2 C51.2 CN1.1 D2.1 D3.1 DC1.2 DC1.3 H1.4 L6.1 NOREF#2.1 P1.2 R3.1 R6.1 R14.1 R20.1 R22.1 R23.1 RF1.2 RF1.3 RF1.4 RF1.5 RF2.2 RF2.3 RF2.4 RF2.5 RF3.2 RF3.3 RF3.4 RF3.5 RF4.2 RF4.3 RF4.4 RF4.5 RF5.2 RF5.3 RF5.4 RF5.5 U1.1 U3.6 U3.10 U3.12 U3.16 U3.18 U3.20 U3.25 U3.28 U3.32 U3.34 U3.38 U3.57 X3.2
NET1: NOREF#3.1 X3.1
$1N5889: NOREF#4.1 U4.3 X3.3

Pads without a net: SCREW1 1; SCREW2 1; SCREW3 1; SCREW4 1; SW1 1 4 5 6

## Via types
v1: diameter 0.635, hole 0.33, Top Layer to Bottom Layer, 133 vias

## Routing (per net, layer and track width the routed paths; a pad name or vN(x,y) marks a point on that pad's centre or on a via; arc(x,y) is an arc through that point)
AVDD-1V8: length 217.2
  Top Layer w0.254: U3.26 42.98,22.55 v1(42.75,22.33) ; U3.37 46.59,28.43 46.74,28.58 v1(46.69,28.63) 46.69,29.08 46.34,29.43 44.68,29.43 ; U3.31 46.56,25.43 46.71,25.58 v1(46.71,26.44) 46.7,26.43 U3.33 ; U3.11 v1(35.03,25.93) ; U3.5 35.38,28.93 v1(35.03,28.58) 35.03,28.07 35.17,27.93 U3.7
  Top Layer w0.305: 39.48,22.6 39.48,21.78 38.8,21.1 35.58,21.1 v1(35.03,20.55) ; 39.48,22.6 39.51,22.58 40.28,22.58 40.48,22.78 U3.21 ; 39.48,22.6 U3.19 ; C34.2 31.51,16.66 33.08,18.23 33.08,21.9 33.58,22.4 37.13,22.4 37.48,22.75 U3.15
  Top Layer w0.508: v1(45.47,18.54) 45.47,16.71 C35.2 ; R2.1 49.98,19.67 49.93,19.72 v1(49.93,18.57) 49.93,16.68 C32.1 C38.2 54.79,16.61 v1(54.81,16.64) ; R5.1 52.35,36.04 v1(52.35,37.37) C37.2 ; C39.2 R19.1 R10.1 ; R8.1 51.84,26.61 51.4,26.18 46.98,26.18 v1(46.71,26.44) ; L1.1 46.78,44.21 46.08,44.91 v1(38.79,44.91) ; R11.1 29.18,38.24 C36.2 28.94,38.1 v1(27.28,38.1) ; R9.1 v1(27.74,27.6)
  Top Layer w0.762: U1.4 U1.2 ; U1.4 66.34,4.13 R1.2 ; U1.4 60.84,4.01 55.82,4.01 C4.2 54.4,5.18 v1(51.31,5.18) 51.31,9.47 54.81,12.98 v1(54.81,16.64) ; C39.2 C34.2
  Bottom Layer w0.305: v1(35.03,20.55) v1(35.03,22.38) 35.08,22.33 v1(42.75,22.33)
  Bottom Layer w0.508: 35.03,25.93 v1(35.03,22.38) ; v1(46.69,28.63) 46.69,26.47 v1(46.71,26.44) 46.71,18.58 46.75,18.54 ; v1(38.79,44.91) 28.35,44.91 27.28,43.84 v1(27.28,38.1) 27.28,28.06 v1(27.74,27.6) 35.02,27.6 35.03,27.6 ; 35.03,27.6 v1(35.03,25.93) ; 35.03,27.6 v1(35.03,28.58) ; v1(54.81,16.64) 54.81,36.96 54.41,37.36 52.35,37.36 ; 46.75,18.54 v1(45.47,18.54) 43.08,18.54 42.72,18.9 42.72,22.3 v1(42.75,22.33) ; 46.75,18.54 49.9,18.54 v1(49.93,18.57)
DGND: length 55.1
  Top Layer w0.254: L6.2 35.05,45.96 35.01,45.92 ; U3.56 35.96,31.63 35.08,32.51 35.08,39.55 34.75,39.88 31.67,39.88 30.99,40.56 30.99,45.34 31.57,45.92 35.01,45.92 ; 35.01,45.92 46.81,45.92 47.73,45.01 47.73,42.88 48.06,42.55 48.06,35.66 46.66,34.26 43.99,34.26 43.48,33.75 U3.44
DVDD-1V8: length 38.5
  Top Layer w0.254: v1(37.33,34.34) 37.33,32.75 37.98,32.1 U3.55 ; L1.2 46.78,37.48 46.79,37.47 46.79,35.84 46.18,35.23 43.44,35.23 42.98,34.77 U3.45
  Top Layer w0.508: L1.2 44.77,40.31 C48.2 44.55,43.08 43.71,43.92 37.8,43.92 36.98,43.1 C47.2 37.55,40.31 C49.2 39.43,37.24 38.48,36.3 v1(37.54,36.3)
  Bottom Layer w0.254: v1(37.54,36.3) 37.33,36.08 v1(37.33,34.34)
DVDD-3V3: length 153.8
  Top Layer w0.254: 42.05,38.58 42.05,38.24 40.51,36.7 40.51,35.2 40.98,34.74 U3.49
  Top Layer w0.508: v1(40.54,39.98) 41.93,38.58 42.05,38.58 ; R4.2 10.66,4.12 11.41,3.38 19.94,3.38 20.58,4.01 20.58,5.56 C42.1
  Top Layer w0.762: C3.2 59.19,12.18 58.61,12.18 ; 58.61,12.18 58.66,12.12 U1.3 ; 58.61,12.18 v1(57.34,12.18) ; U2.2 U2.4 42.09,50.92 C11.2 42.36,48.27 v1(42.36,46.83) ; v1(31.22,12.14) 31.2,12.12 C51.1 C50.1 29.51,9.47 NOREF.1 ; v1(20.55,9.93) C41.1 20.55,5.61 C42.1
  Bottom Layer w0.508: v1(40.54,39.98) 40.54,46.04 40.53,46.05
  Bottom Layer w0.762: 20.55,12.14 20.55,44.12 22.48,46.05 41.58,46.05 v1(42.36,46.83) ; 20.55,12.14 v1(20.55,9.93) ; 20.55,12.14 20.59,12.18 v1(57.34,12.18)
GND: length 29.4
  Top Layer w0.254: 41.48,26.93 U3.57 ; 41.48,26.93 U3.34 ; 41.48,26.93 42.48,25.93 ; U3.57 41.98,28.93 U3.38 ; U3.57 39.98,28.43 v1(39.65,28.43) v1(38.64,28.43) U3.6 ; U3.10 39.48,26.43 ; U3.16 37.98,24.93 38.48,25.43 U3.12 ; U3.32 42.48,25.93 ; 42.48,25.93 42.48,23.73 ; U3.20 39.98,26.93
  Top Layer w0.381: v1(36.23,39.14) 36.98,38.39 C47.1
  vias: v1(1.9,28.6) v1(1.9,26.74) v1(1.95,24.7) v1(3.66,28.6) v1(3.66,26.74) v1(3.71,24.7) v1(5.43,28.6) v1(5.43,26.74) v1(5.48,24.7) v1(7.65,14.33) v1(7.65,12.23) v1(7.65,10.14) v1(9.41,14.33) v1(9.41,12.23) v1(9.41,10.14) v1(11.18,14.33) v1(11.18,12.23) v1(11.18,10.14) v1(11.35,39.08) v1(13.12,39.08) v1(14.88,39.08) v1(22.05,43.1) v1(22.05,41.48) v1(22.08,39.65) v1(23.25,16.75) v1(23.25,15.39) v1(23.28,13.85) v1(23.82,43.1) v1(23.82,41.48) v1(23.84,39.65) v1(25.02,16.75) v1(25.02,15.39) v1(25.04,13.85) v1(25.58,43.1) v1(25.58,41.48) v1(25.61,39.65) v1(26.78,16.75) v1(26.78,15.39) v1(26.8,13.85) v1(29.68,42.2) v1(35.5,42) v1(38.63,29.69) v1(38.64,27.22) v1(38.63,25.88) v1(39.18,40.03) v1(39.65,29.69) v1(39.65,27.22) v1(39.65,25.88) v1(40.67,29.69) v1(40.67,28.43) v1(40.67,27.22) v1(40.67,25.88) v1(41.69,29.69) v1(41.69,28.43) v1(41.69,27.22) v1(41.69,25.88) v1(42.7,29.69) v1(42.71,28.43) v1(42.71,27.22) v1(42.7,25.88) v1(68,15.83) v1(68.05,11.4) v1(68.1,13.73) v1(69.77,15.83) v1(69.87,13.73) v1(69.82,11.4) v1(71.53,15.83) v1(71.58,11.4) v1(71.63,13.73) v1(75.48,50.38) v1(75.53,48.25) v1(75.53,45.9) v1(75.85,26.88) v1(75.9,28.68) v1(75.9,25.13) v1(77.24,50.38) v1(77.29,48.25) v1(77.29,45.9) v1(77.67,28.68) v1(77.62,26.88) v1(77.67,25.13) v1(79.01,50.38) v1(79.06,48.25) v1(79.06,45.9) v1(79.38,26.88) v1(79.43,28.68) v1(79.43,25.13)
AD9959-CLK: length 9.5
  Top Layer w0.254: U3.23 41.48,20.53 40.8,19.85 38.88,19.85 38.42,19.39 38.42,16.64 C43.2
CH0: length 15.7
  Top Layer w0.254: L2.1 54.92,21.85 C6.2 R2.2 52.4,24.43 51.9,24.93 U3.30
CH0-: length 7.7
  Top Layer w0.254: 49.93,21.72 49.93,24.05 49.55,24.43 U3.29
CH1: length 17.4
  Top Layer w0.254: L7.1 54.82,30.27 54.25,29.7 49.18,29.7 47.41,27.93 U3.36
  Top Layer w0.508: L7.1 54.88,31.34 C15.2 R5.2
CH1-: length 5.3
  Top Layer w0.254: U3.35 49.54,27.43 R8.2
CH2: length 17
  Top Layer w0.254: L11.1 29.84,31.23 32.48,28.59 32.48,28 33.05,27.43 U3.8
  Top Layer w0.508: R11.2 C21.2 26.91,33.7 L11.1
CH2-: length 5.8
  Top Layer w0.254: R9.2 31.97,26.93 36.07,26.93 36.07,26.93 U3.9
CH3: length 15.3
  Top Layer w0.254: U3.13 29.78,24.93 29.2,24.35 R19.2
  Top Layer w0.508: L15.1 26.89,21.85 C27.2 R19.2
CH3-: length 7.6
  Top Layer w0.254: U3.14 36.07,24.43 36.07,24.43 32.1,24.43 31.43,23.75 R10.2
CS: length 30.9
  Top Layer w0.254: v1(59.49,42.14) 59.49,44.4 59.45,44.44 59.45,45.26 ; v1(41.85,36.04) 41.98,35.92 U3.47
  Bottom Layer w0.254: v1(59.49,42.14) 59.49,42.04 59.06,41.61 43.82,41.61 43.31,41.1 43.31,36.12 43.02,35.83 42.06,35.83 v1(41.85,36.04)
IO_UPDATE: length 28
  Top Layer w0.254: 57.41,45.26 57.35,45.21 v1(57.35,42.28) ; v1(42.69,36.7) 42.48,36.49 42.48,31.63
  Bottom Layer w0.254: v1(57.35,42.28) 57.32,42.32 43.44,42.32 42.69,41.57 v1(42.69,36.7)
P0: length 20.3
  Top Layer w0.254: R32.1 51.27,44.62 49.86,43.21 49.86,31.36 arc(49.76,31.26) 49.67,31.15 48.44,29.93 44.68,29.93 U3.40
P1: length 21.5
  Top Layer w0.254: v1(48.16,30.71) 47.88,30.43 U3.41 ; v1(50.52,31.01) 50.52,42.47 R31.1
  Bottom Layer w0.254: v1(48.16,30.71) 50.22,30.71 v1(50.52,31.01)
P2: length 17.7
  Top Layer w0.254: R30.1 49.23,32.87 47.3,30.94 44.68,30.94 U3.42
P3: length 23.9
  Top Layer w0.254: v1(48.57,43.71) 48.57,33.38 46.82,31.63 U3.43 ; v1(55.35,43.87) 55.35,45.25 R29.1
  Bottom Layer w0.254: v1(55.35,43.87) 55.2,43.71 v1(48.57,43.71)
PDC: length 67.8
  Top Layer w0.254: v1(32.99,28.95) 33.47,29.43 36.78,29.43
  Bottom Layer w0.254: v1(32.99,28.95) 32.28,29.66 32.28,30.61 32.72,31.04 35.36,31.04 36.07,31.75 36.07,36.65 37.31,37.9 41,37.9 41.58,38.48 41.58,42.16 42.9,43.48 46.58,43.48 47.24,44.14 47.24,57.5 48.04,58.29 67.39,58.29 68.02,57.66 P1.1
REST: length 47
  Top Layer w0.254: v1(63.53,43.66) 63.54,43.68 63.54,45.26 ; U3.3 33.19,29.93 v1(33.12,30)
  Bottom Layer w0.254: v1(33.12,30) 36.2,30 36.7,30.51 36.7,36.4 37.67,37.36 41.48,37.36 42.17,38.05 42.17,41.86 43.28,42.98 62.84,42.98 v1(63.53,43.66)
SCLK: length 33.3
  Top Layer w0.254: v1(41.35,35.4) 41.48,35.27 U3.48 ; 61.5,45.26 61.5,44.44 61.44,44.39 v1(61.44,41.33)
  Bottom Layer w0.254: v1(61.44,41.33) 61.24,41.12 44.22,41.12 43.89,40.79 43.89,35.76 43.53,35.4 v1(41.35,35.4)
SDIO0: length 40
  Top Layer w0.254: R28.1 65.59,44.44 65.58,44.44 v1(65.58,40.89) ; v1(39.55,35.06) 39.56,35.08 39.85,35.08 40.48,34.45 U3.50
  Bottom Layer w0.254: v1(39.55,35.06) 39.8,34.81 40.11,34.81 40.15,34.78 43.95,34.78 44.43,35.25 44.43,40.26 44.76,40.59 65.28,40.59 v1(65.58,40.89)
SDIO1: length 40.6
  Top Layer w0.254: U3.51 39.98,34.07 v1(39.86,34.19) ; v1(67.62,40.56) 67.62,44.42 67.63,44.44 R27.1
  Bottom Layer w0.254: v1(67.62,40.56) 67.06,40 45.44,40 44.96,39.52 44.96,34.59 44.55,34.19 v1(39.86,34.19)
SDIO2: length 45.2
  Top Layer w0.254: v1(71.73,39.19) 71.73,44.43 71.72,44.44 R26.1 ; U3.52 39.48,32.8 v1(39.36,32.92)
  Bottom Layer w0.254: v1(39.36,32.92) 39.38,32.9 45.29,32.9 46,33.6 46,38.2 46.61,38.81 71.48,38.81 71.73,39.06 v1(71.73,39.19)
SDIO3: length 43.7
  Top Layer w0.254: v1(38.66,33.6) 38.66,32.74 38.98,32.42 U3.53 ; v1(69.7,40.23) 69.7,44.42 69.68,44.44 R25.1
  Bottom Layer w0.254: v1(38.66,33.6) 38.66,33.55 44.83,33.55 45.44,34.16 45.44,38.66 46.2,39.42 68.96,39.42 69.7,40.16 v1(69.7,40.23)
SYNC-CLK: length 13.6
  Top Layer w0.254: H1.3 35.05,41.05 35.59,40.51 35.59,35.91 35.89,35.61 37.42,35.61 38.04,34.99 38.04,32.65 38.48,32.21 U3.54
SYNC-IN: length 10.7
  Top Layer w0.254: H1.2 34.27,38.51 34.52,38.25 34.52,31.6 35.19,30.93 U3.1
SYNC-OUT: length 8.8
  Top Layer w0.254: H1.1 33.15,31.05 33.78,30.43 36.02,30.43 36.02,30.43 U3.2
$1N34: length 11.4
  Top Layer w0.254: U3.17 38.48,21.96 38.22,21.7 34.28,21.7 33.83,21.25 33.83,17.44 33.82,17.43 R22.2
$1N39: length 11.3
  Top Layer w0.254: C33.2 36.15,16.63 36.15,16.99 36.14,16.99 36.14,19.86 36.74,20.46 40.37,20.46 40.98,21.06 U3.22
$1N43: length 10.7
  Top Layer w0.254: R21.2 47.68,19.25 47.13,19.8 44.03,19.8 43.48,20.35 U3.27
$1N48: length 2.3
  Top Layer w0.305: R21.1 C32.2
$1N72: length 22.3
  Top Layer w0.762: C1.1 23.63,48.28 25.6,50.25 25.6,55.05 26.23,55.68 SW1.2 31.1,55.68 34.03,58.6 C12.2 37.85,58.6 U2.3
$1N80: length 2.6
  Top Layer w0.762: D2.2 69.92,7.93 R1.1
$1N83: length 2.6
  Top Layer w0.762: D3.2 12.66,8.21 R4.1
$1N111: length 4.6
  Top Layer w0.254: C7.2 58.85,24.21 L3.1 L2.2
$1N112: length 4.7
  Top Layer w0.254: C8.2 62.98,24.2 L4.1 L3.2
$1N113: length 4.7
  Top Layer w0.254: C9.2 67.14,21.73 L5.1 L4.2
$1N114: length 4.7
  Top Layer w0.254: C10.2 71.29,21.68 C5.2 L5.2
$1N115: length 11.4
  Top Layer w0.254: R3.2 73.75,23.79 C5.1
  Top Layer w0.381: RF1.1 75.98,17.1 75.38,17.7 75.38,21.03 74.74,21.67 R3.2
$1N121: length 11.4
  Top Layer w0.381: RF2.1 75.88,38.28 75.4,37.8 75.4,34.4 74.96,33.96 R6.2 73.63,31.53 C14.1
$1N122: length 5
  Top Layer w0.254: L10.2 C14.2 71.37,33.74 C19.2
$1N123: length 4.8
  Top Layer w0.254: 65.07,31.28 L10.1 67.18,31.29 C18.2
$1N124: length 4.8
  Top Layer w0.254: L8.2 63.07,31.28 63.07,33.95 C17.2
$1N125: length 4.8
  Top Layer w0.254: C16.2 58.95,31.29 L8.1 L7.2
$1N130: length 11.2
  Top Layer w0.254: C20.1 8.09,33.57 R14.2
  Top Layer w0.381: R14.2 7.7,33.86 6.68,33.86 5.87,34.67 5.87,37.47 5.31,38.03 RF3.1
$1N131: length 5.1
  Top Layer w0.254: C25.2 10.23,31.36 C20.2 L14.2
$1N132: length 4.6
  Top Layer w0.254: C24.2 14.46,33.65 L14.1 L13.2
$1N133: length 4.9
  Top Layer w0.254: L12.2 L13.1 18.61,33.88 C23.2
$1N134: length 4.9
  Top Layer w0.254: L12.1 L11.2
  Top Layer w0.305: C22.2 22.6,31.39 L12.1
$1N139: length 11.7
  Top Layer w0.254: C26.1 8.09,22 R20.2
  Top Layer w0.381: 7.77,21.69 6.58,21.69 6.12,21.23 6.12,17.58 5.52,16.98 RF4.1
$1N140: length 5
  Top Layer w0.254: 10.28,21.72 10.28,24.06 C26.2 L18.2
$1N141: length 4.7
  Top Layer w0.254: L17.2 L18.1 14.46,21.77 C30.2
$1N142: length 4.7
  Top Layer w0.254: L16.2 L17.1 18.68,24.17 C29.2
$1N143: length 4.7
  Top Layer w0.254: L15.2 L16.1 22.74,21.78 C28.2
$1N149: length 30.8
  Top Layer w0.762: SW1.3 29.15,59.15 28.38,59.93 20.58,59.93 19.8,59.15 19.8,42.68 19.46,42.34 D1.2
$1N152: length 8.2
  Top Layer w0.254: 65.48,53.61 65.48,51.33 69.55,47.26 R25.2
$1N153: length 11.5
  Top Layer w0.254: 65.48,56.15 66.75,54.88 66.75,52.11 71.6,47.26 R26.2
$1N154: length 8.4
  Top Layer w0.254: R27.2 67.51,47.26 62.94,51.83 P1.6
$1N155: length 11.1
  Top Layer w0.254: P1.5 61.72,54.93 61.72,51.56 61.75,51.54 61.75,50.98 65.46,47.26 R28.2
$1N156: length 9.8
  Top Layer w0.254: 57.41,47.26 57.41,48.41 56.64,49.17 56.64,55.12 57.67,56.15 P1.9
$1N157: length 7
  Top Layer w0.254: P1.10 57.81,53.56 57.81,49.45 59.45,47.81 59.45,47.26
$1N158: length 10.1
  Top Layer w0.254: R32.2 51.27,55.59 51.83,56.15 P1.13
$1N159: length 6.6
  Top Layer w0.254: P1.14 53.32,53.07 R31.2
$1N160: length 20
  Top Layer w0.254: P1.11 55.32,58.57 54.99,58.9 49.68,58.9 49.23,58.45 R30.2
$1N161: length 6.4
  Top Layer w0.254: R29.2 55.36,53.57 P1.12
$1N162: length 10.4
  Top Layer w0.254: P1.7 59.18,54.93 59.18,49.73 61.5,47.42 61.5,47.26
$1N163: length 7.7
  Top Layer w0.254: 63.54,47.26 63.42,47.26 60.4,50.28 P1.8
$1N168: length 9.9
  Top Layer w0.254: U3.24 41.98,20 40.75,18.78 R23.2 R24.2
$1N5889: length 14.3
  Top Layer w0.305: U4.3 38.15,6.58 37.23,5.66 X3.3
$1N5898: length 6.3
  Top Layer w0.305: C43.1 38.44,13.74 38.46,13.73 38.46,11.96 40.69,9.73 U4.2
$1N5956: length 7.6
  Top Layer w0.305: RF5.1 40.8,5.34 43.23,7.77 U4.1
$1N9705: length 18.1
  Top Layer w0.762: CN1.2 3.94,44.93 6.55,42.32 D1.1 11.98,42.32 11.98,45.75 12.75,46.53 DC1.1

## Copper pours and planes (outline as drawn; the poured copper is in the pictures)
GND on Top Layer: -7.4,69.65 84.43,69.65 84.43,-8.13 -7.4,-8.13
GND on Bottom Layer: -10.93,71.8 86.78,71.8 86.78,-11.65 -10.93,-11.65

## Text on the board
Bottom Silkscreen Layer: P0 | C1 | P2 | P3 | IO | CS | RE | CLK | D0 | D1 | D2 | D3 | PDC | GND
Document Layer: C1,C10,C16,C24旁的电容电阻不焊接 | AD9959测试引脚为17脚，上电后该脚的电压为1.2V左右 / 若无电压，则出现虚焊或者没有供电 | AD9958和AD9959源码相同，唯一区别是通道数 / AD9959可用CH0、CH1 / AD9958的CH1为板子标注CH3 / AD9958的CH0为板子标注CH2 / 若使用9958,只需焊接R1,R4,R11,R12,C2,C11
Top Silkscreen Layer: GND | 5V | AD9959 / DDS | CH3 | CH2 | CH1 | CH0 | CLK
